# EAGLE schematic PCB2 (EAGLE 9.3.1)

## Sheet 1 of 2
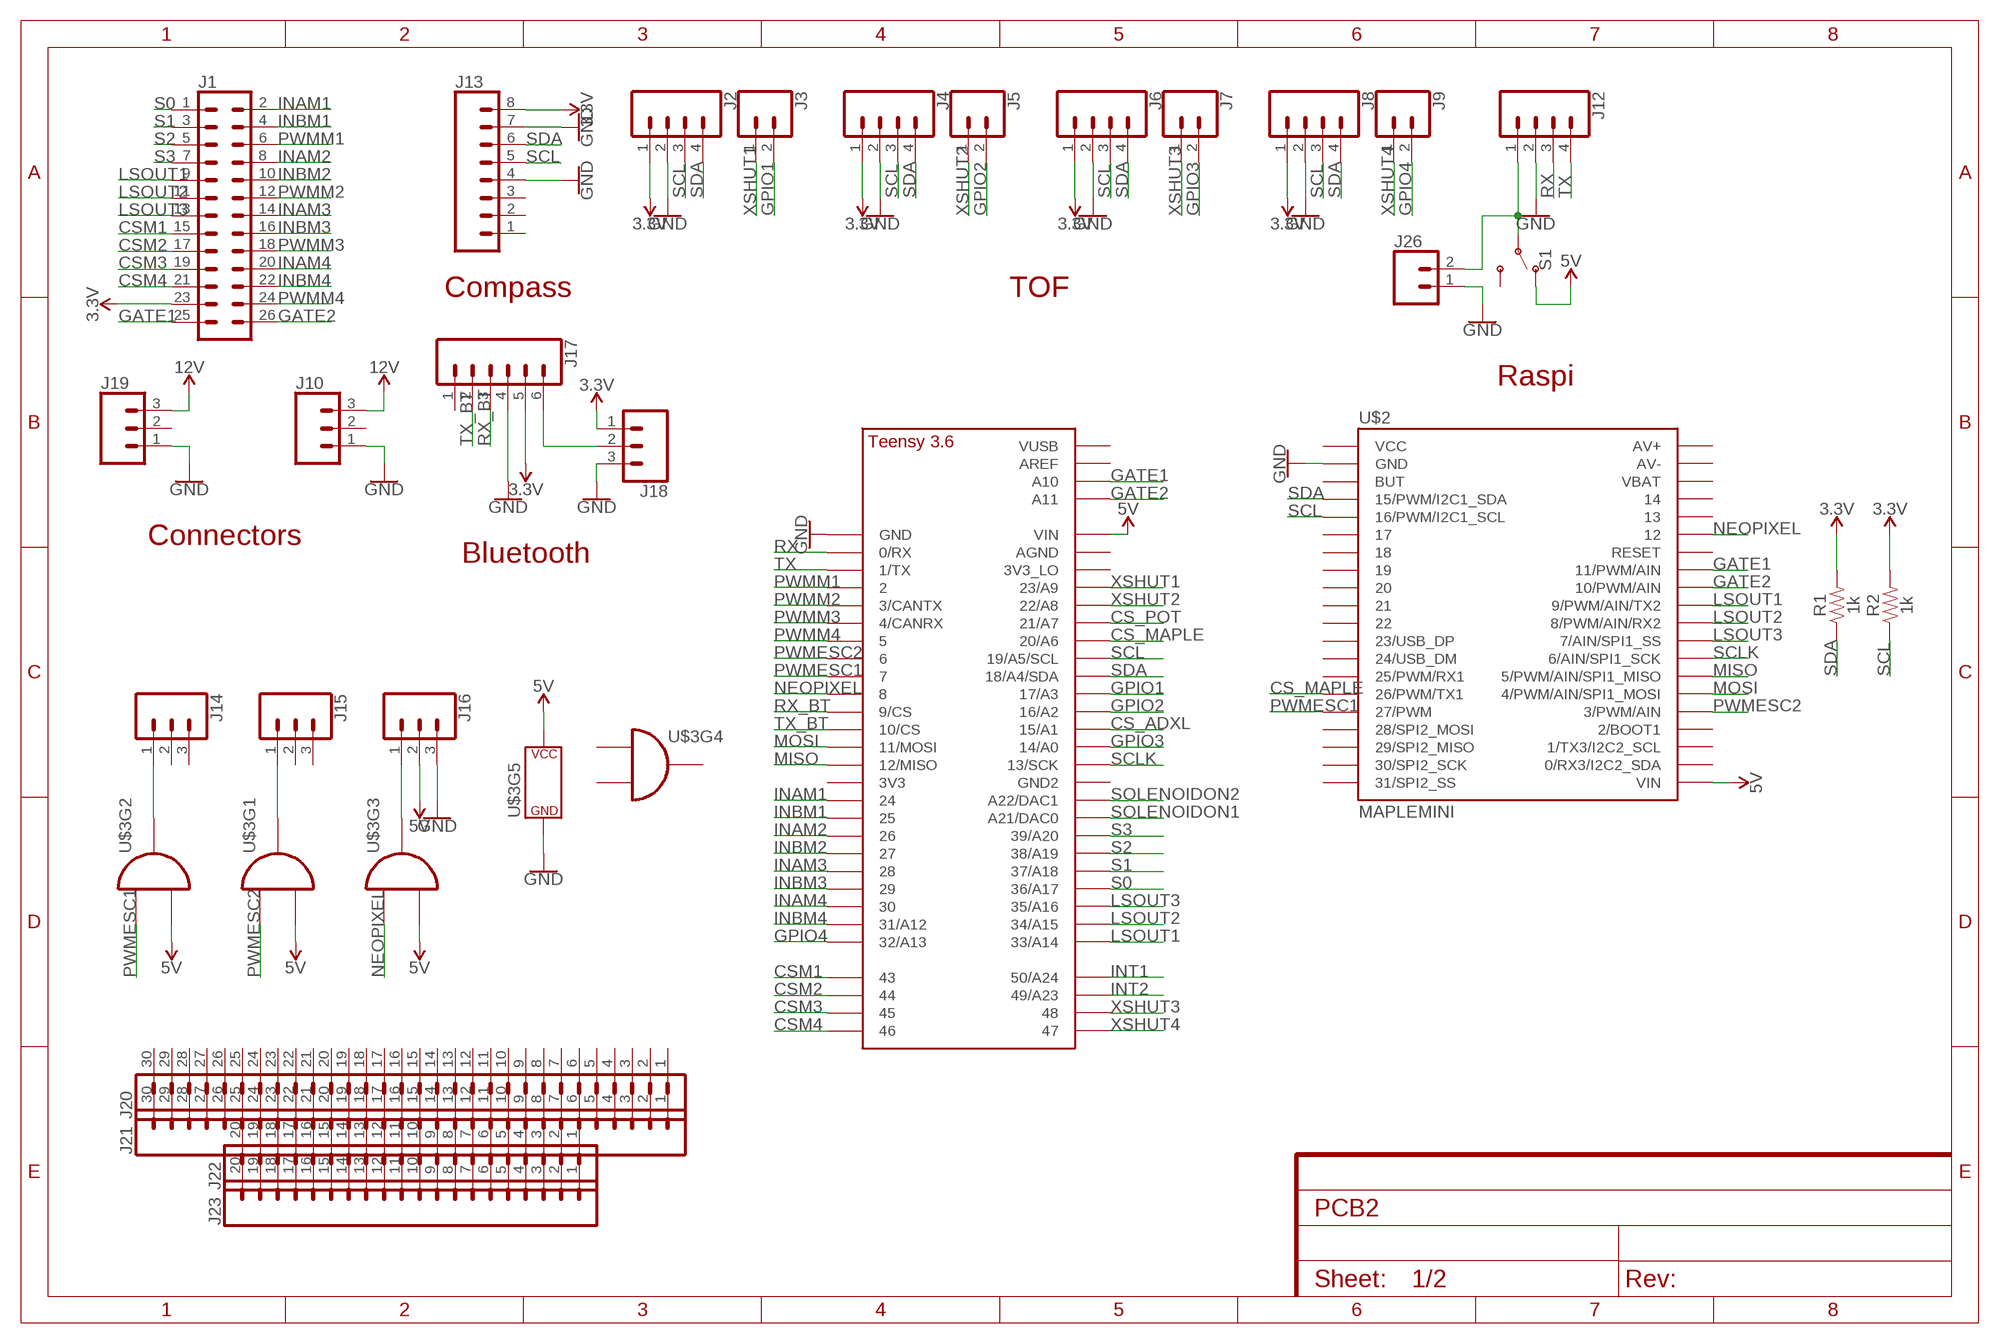
[diagram p0: schematic, sheet 1]

### Parts
J1  CONN_13X22X13  [2X13]
J2  CONN_04LOCK  [1X04_LOCK]
J3  CONN_02LOCK  [1X02_LOCK]
J4  CONN_04LOCK  [1X04_LOCK]
J5  CONN_02LOCK  [1X02_LOCK]
J6  CONN_04LOCK  [1X04_LOCK]
J7  CONN_02LOCK  [1X02_LOCK]
J8  CONN_04LOCK  [1X04_LOCK]
J9  CONN_02LOCK  [1X02_LOCK]
J10  CONN_03-SCREW-5MM  [SCREWTERMINAL-5MM-3]
J12  CONN_04LOCK  [1X04_LOCK]
J13  CONN_08LOCK  [1X08_LOCK]
J14  CONN_03LOCK  [1X03_LOCK]
J15  CONN_03LOCK  [1X03_LOCK]
J16  CONN_03LOCK  [1X03_LOCK]
J17  CONN_06LOCK  [1X06_LOCK]
J18  CONN_03LOCK  [1X03_LOCK]
J19  CONN_03-SCREW-5MM  [SCREWTERMINAL-5MM-3]
J20  CONN_30  [1X30]
J21  CONN_30  [1X30]
J22  CONN_20  [1X20]
J23  CONN_20  [1X20]
J26  CONN_02LOCK  [1X02_LOCK]
R1  1k  1KOHM-0603-1/10W-1%  [0603]
R2  1k  1KOHM-0603-1/10W-1%  [0603]
S1  SWITCH-SPDT-PTH-11.6X4.0MM-LOCK  [SWITCH_SPDT_PTH_11.6X4.0MM_LOCK]
U$1  TEENSY_3.5/3.6_BASIC  [TEENSY_3.5/3.6_BASIC]
U$2  MAPLEMINI  [20-DIP]
U$3  74HCT08  [SOIC-14]

### Nets
3.3V: J1.23 J2.1 J4.1 J6.1 J8.1 J13.8 J17.5 J18.1 R1.2 R2.2 ; also sheet 2
5V: J16.2 S1.1(O) U$1.VIN U$2.21(VIN) U$3.P2(I1) U$3.P5(I1) U$3.P10(I1) U$3.P14(P$V+) ; also sheet 2
12V: J10.3 J19.3 ; also sheet 2
CS_ADXL: U$1.15/A1 ; also sheet 2
CS_MAPLE: U$1.20/A6 U$2.15(26/PWM/TX1)
CS_POT: U$1.21/A7 ; also sheet 2
CSM1: J1.15 U$1.43
CSM2: J1.17 U$1.44
CSM3: J1.19 U$1.45
CSM4: J1.21 U$1.46
GATE1: J1.25 U$1.A10 U$2.33(11/PWM/AIN)
GATE2: J1.26 U$1.A11 U$2.32(10/PWM/AIN)
GND: J2.2 J4.2 J6.2 J8.2 J10.1 J12.2 J13.4 J13.7 J16.3 J17.4 J18.3 J19.1 J26.1 U$1.GND U$2.2(GND) U$3.P7(P$V-) ; also sheet 2
GPIO1: J3.2 U$1.17/A3
GPIO2: J5.2 U$1.16/A2
GPIO3: J7.2 U$1.14/A0
GPIO4: J9.2 U$1.32/A13
INAM1: J1.2 U$1.24
INAM2: J1.8 U$1.26
INAM3: J1.14 U$1.28
INAM4: J1.20 U$1.30
INBM1: J1.4 U$1.25
INBM2: J1.10 U$1.27
INBM3: J1.16 U$1.29
INBM4: J1.22 U$1.31/A12
INT1: U$1.50/A24 ; also sheet 2
INT2: U$1.49/A23 ; also sheet 2
LSOUT1: J1.9 U$1.33/A14 U$2.31(9/PWM/AIN/TX2)
LSOUT2: J1.11 U$1.34/A15 U$2.30(8/PWM/AIN/RX2)
LSOUT3: J1.13 U$1.35/A16 U$2.29(7/AIN/SPI1_SS)
MISO: U$1.12/MISO U$2.27(5/PWM/AIN/SPI1_MISO) ; also sheet 2
MOSI: U$1.11/MOSI U$2.26(4/PWM/AIN/SPI1_MOSI) ; also sheet 2
N$1: J12.1 J26.2 S1.2(P)
N$3: J16.1 U$3.P8(O)
N$4: J14.1 U$3.P6(O)
N$6: J15.1 U$3.P3(O)
N$11: J17.6 J18.2
NEOPIXEL: U$1.8 U$2.35 U$3.P9(I0)
PWMESC1: U$1.7 U$2.16(27/PWM) U$3.P4(I0)
PWMESC2: U$1.6 U$2.25(3/PWM/AIN) U$3.P1(I0)
PWMM1: J1.6 U$1.2
PWMM2: J1.12 U$1.3/CANTX
PWMM3: J1.18 U$1.4/CANRX
PWMM4: J1.24 U$1.5
RX: J12.3 U$1.0/RX
RX_BT: J17.3 U$1.9/CS
S0: J1.1 U$1.36/A17
S1: J1.3 U$1.37/A18
S2: J1.5 U$1.38/A19
S3: J1.7 U$1.39/A20
SCL: J2.3 J4.3 J6.3 J8.3 J13.5 R2.1 U$1.19/A5/SCL U$2.5(16/PWM/I2C1_SCL)
SCLK: U$1.13/SCK U$2.28(6/AIN/SPI1_SCK) ; also sheet 2
SDA: J2.4 J4.4 J6.4 J8.4 J13.6 R1.1 U$1.18/A4/SDA U$2.4(15/PWM/I2C1_SDA)
SOLENOIDON1: U$1.21/DAC0(A21/DAC0) ; also sheet 2
SOLENOIDON2: U$1.A22/DAC1 ; also sheet 2
TX: J12.4 U$1.1/TX
TX_BT: J17.2 U$1.10/CS
XSHUT1: J3.1 U$1.23/A9
XSHUT2: J5.1 U$1.22/A8
XSHUT3: J7.1 U$1.48
XSHUT4: J9.1 U$1.47
Unconnected: J10.2 J13.1 J13.2 J13.3 J14.2 J14.3 J15.2 J15.3 J17.1 J19.2 J20.1 J20.2 J20.3 J20.4 J20.5 J20.6 J20.7 J20.8 J20.9 J20.10 J20.11 J20.12 J20.13 J20.14 J20.15 J20.16 J20.17 J20.18 J20.19 J20.20 J20.21 J20.22 J20.23 J20.24 J20.25 J20.26 J20.27 J20.28 J20.29 J20.30 J21.1 J21.2 J21.3 J21.4 J21.5 J21.6 J21.7 J21.8 J21.9 J21.10 J21.11 J21.12 J21.13 J21.14 J21.15 J21.16 J21.17 J21.18 J21.19 J21.20 J21.21 J21.22 J21.23 J21.24 J21.25 J21.26 J21.27 J21.28 J21.29 J21.30 J22.1 J22.2 J22.3 J22.4 J22.5 J22.6 J22.7 J22.8 J22.9 J22.10 J22.11 J22.12 J22.13 J22.14 J22.15 J22.16 J22.17 J22.18 J22.19 J22.20 J23.1 J23.2 J23.3 J23.4 J23.5 J23.6 J23.7 J23.8 J23.9 J23.10 J23.11 J23.12 J23.13 J23.14 J23.15 J23.16 J23.17 J23.18 J23.19 J23.20 S1.3(S) U$1.3V3 U$1.3V3_LO U$1.AGND U$1.AREF U$1.GND2 U$1.VUSB U$2.1(VCC) U$2.3(BUT) U$2.6 U$2.7 U$2.8 U$2.9 U$2.10 U$2.11 U$2.12(23/USB_DP) U$2.13(24/USB_DM) U$2.14(25/PWM/RX1) U$2.17(28/SPI2_MOSI) U$2.18(29/SPI2_MISO) U$2.19(30/SPI2_SCK) U$2.20(31/SPI2_SS) U$2.22(0/RX3/I2C2_SDA) U$2.23(1/TX3/I2C2_SCL) U$2.24(2/BOOT1) U$2.34(RESET) U$2.36 U$2.37 U$2.38(VBAT) U$2.39(AV-) U$2.40(AV+) U$3.P11(O) U$3.P12(I0) U$3.P13(I1)

### Notes on the sheet
- Compass | TOF
- Raspi
- Connectors
- Bluetooth

## Sheet 2 of 2
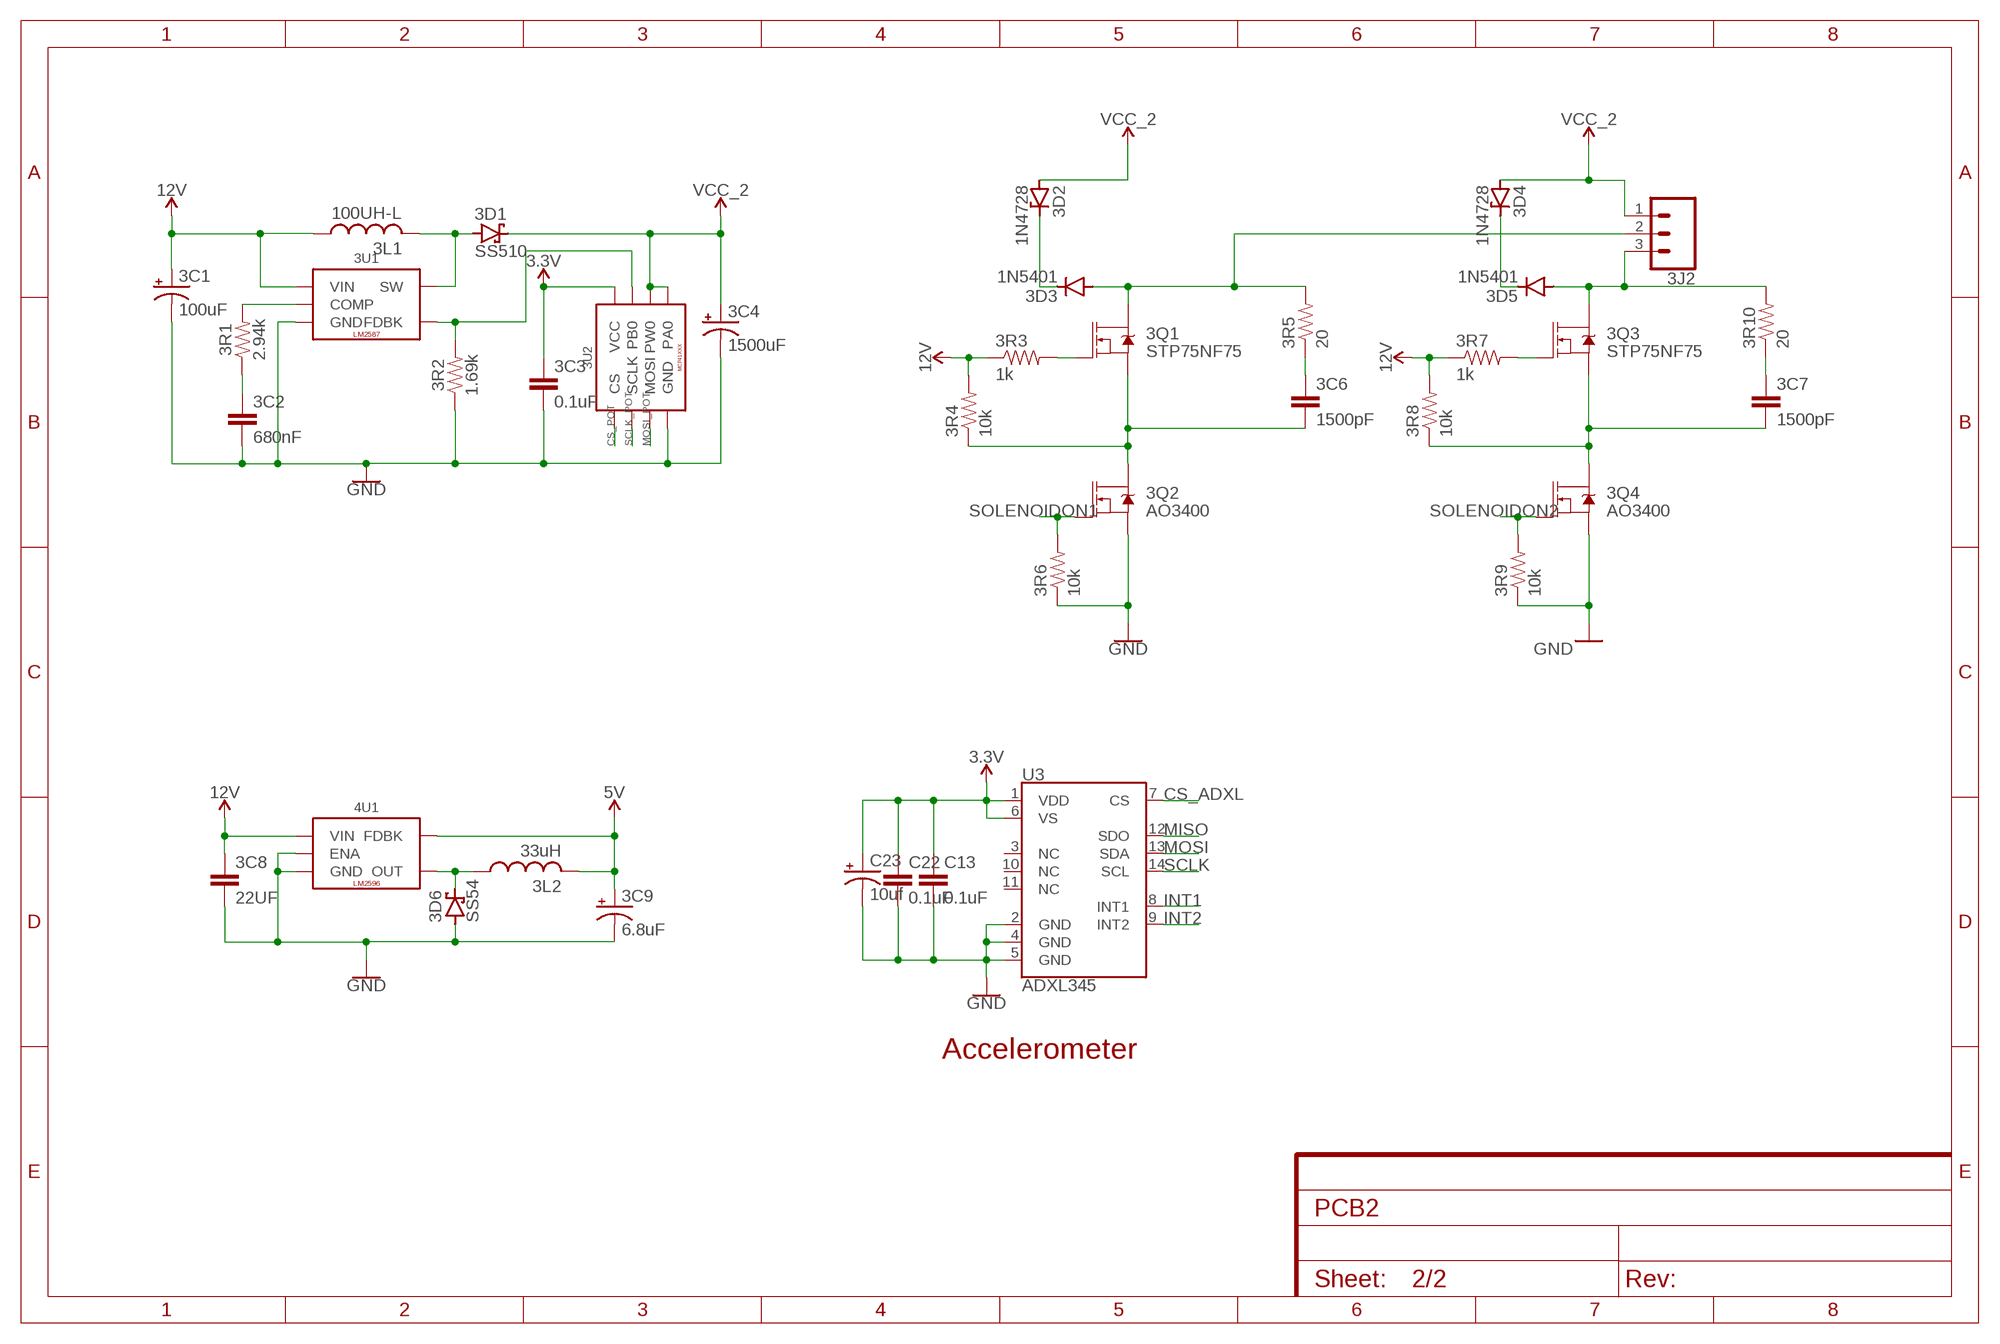
[diagram p1: schematic, sheet 2]

### Parts
3C1  100uF  100UF-POLAR-25V-20%(ELEC)  [PANASONIC_D]
3C2  680nF  680PF-0603-50V-10%  [0603]
3C3  0.1uF  0.1UF-0603-25V-5%  [0603]
3C4  1500uF  1000UF-CAP  [1000UF-CAP]
3C6  1500pF  1.5PF-0603-50V-16.667%  [0603]
3C7  1500pF  1.5PF-0603-50V-16.667%  [0603]
3C8  22UF  22UF-1210-16V-20%  [1210]
3C9  6.8uF  CPOL-USA/3216-18R  [A/3216-18R]
3D1  SS510  SCHOTTKY-DIODESMD  [SMB]
3D2  1N4728  [DO41Z10]
3D3  1N5401  1N5400  [DO201-15]
3D4  1N4728  [DO41Z10]
3D5  1N5401  1N5400  [DO201-15]
3D6  SS54  SCHOTTKY-DIODESMD  [SMB]
3J2  CONN_03-SCREW-5MM  [SCREWTERMINAL-5MM-3]
3L1  100UH-L  [100UH-L]
3L2  33uH  CDRH127  [127]
3Q1  STP75NF75  MOSFET-NCH-FQP30N06L  [TO220V]
3Q2  AO3400  MOSFET-NCH-AO3404A  [SOT23-3]
3Q3  STP75NF75  MOSFET-NCH-FQP30N06L  [TO220V]
3Q4  AO3400  MOSFET-NCH-AO3404A  [SOT23-3]
3R1  2.94k  RESISTOR0603  [0603]
3R2  1.69k  2.0KOHM-0603-1/10W-5%  [0603]
3R3  1k  1KOHM-0603-1/10W-1%  [0603]
3R4  10k  10KOHM-0603-1/10W-1%  [0603]
3R5  20  20OHM-0603-1/10W-1%  [0603]
3R6  10k  10KOHM-0603-1/10W-1%  [0603]
3R7  1k  1KOHM-0603-1/10W-1%  [0603]
3R8  10k  10KOHM-0603-1/10W-1%  [0603]
3R9  10k  10KOHM-0603-1/10W-1%  [0603]
3R10  20  20OHM-0603-1/10W-1%  [0603]
3U1  LM2587  [TO-263]
3U2  MCP41XXX  [SOIC-8]
4U1  LM2596  [TO-263]
C13  0.1uF  0.1UF-0603-100V-10%  [0603]
C22  0.1uF  0.1UF-0603-100V-10%  [0603]
C23  10uf  CPOL-USR/2012-12R  [R/2012-12R]
U3  ADXL345  [LGA-14]

### Nets
3.3V: 3C3.1 3U2.8(VCC) C13.1 C22.1 C23.+ U3.1(VDD) U3.6(VS) ; also sheet 1
5V: 3C9.+ 3L2.2 4U1.P4(FDBK) ; also sheet 1
12V: 3C1.+ 3C8.1 3L1.P1 3R3.1 3R4.2 3R7.1 3R8.2 3U1.P5(VIN) 4U1.P1(VIN) ; also sheet 1
CS_ADXL: U3.7(CS) ; also sheet 1
CS_POT: 3U2.1(CS) ; also sheet 1
GND: 3C1.- 3C2.2 3C3.2 3C4.- 3C8.2 3C9.- 3D6.A 3Q2.2(S) 3Q4.2(S) 3R2.1 3R6.1 3R9.1 3U1.P3(GND) 3U2.4(GND) 4U1.P3(GND) 4U1.P5(ENA) 4U1.TAB(GND) C13.2 C22.2 C23.- U3.2(GND) U3.4(GND) U3.5(GND) ; also sheet 1
INT1: U3.8(INT1) ; also sheet 1
INT2: U3.9(INT2) ; also sheet 1
MISO: U3.12(SDO) ; also sheet 1
MOSI: U3.13(SDA) ; also sheet 1
MOSI_POT: 3U2.3(MOSI)
N$34: 3D1.A 3L1.P2 3U1.P4(SW)
N$35: 3C6.2 3Q1.3(S) 3Q2.3(D) 3R4.1
N$36: 3R1.2 3U1.P1(COMP)
N$37: 3C2.1 3R1.1
N$38: 3Q1.1(G) 3R3.2
N$39: 3D2.C 3D3.C
N$40: 3C6.1 3R5.1
N$42: 3C7.2 3Q3.3(S) 3Q4.3(D) 3R8.1
N$43: 3Q3.1(G) 3R7.2
N$44: 3D4.C 3D5.C
N$45: 3C7.1 3R10.1
N$47: 3D6.C 3L2.1 4U1.P2(OUT)
N$103: 3R2.2 3U1.P2(FDBK) 3U2.7(PB0)
SCLK: U3.14(SCL) ; also sheet 1
SCLK_POT: 3U2.2(SCLK)
SOLENOID-: 3D3.A 3J2.2 3Q1.2(D) 3R5.2
SOLENOID-1: 3D5.A 3J2.3 3Q3.2(D) 3R10.2
SOLENOIDON1: 3Q2.1(G) 3R6.2 ; also sheet 1
SOLENOIDON2: 3Q4.1(G) 3R9.2 ; also sheet 1
VCC_2: 3C4.+ 3D1.C 3D2.A 3D4.A 3J2.1 3U2.5(PA0) 3U2.6(PW0)
Unconnected: U3.3(NC) U3.10(NC) U3.11(NC)

### Notes on the sheet
- Accelerometer

## Library data of the parts
3C1 = SparkFun-Capacitors:100UF-POLAR: 100µF polarized capacitors A capacitor is a passive two-terminal electrical component used to store electrical energy temporarily in an electric field.; PROD_ID: CAP-12547
3C2 = SparkFun-Capacitors:680PF: 680pF/0.68nF ceramic capacitors A capacitor is a passive two-terminal electrical component used to store electrical energy temporarily in an electric field.; PROD_ID: CAP-09232; VALUE: 680pF
3C3 = SparkFun-Capacitors:0.1UF: 0.1µF ceramic capacitors A capacitor is a passive two-terminal electrical component used to store electrical energy temporarily in an electric field.; PROD_ID: CAP-08604
3C4 = JH:1000UF-CAP
3C6 3C7 = SparkFun-Capacitors:1.5PF: 1.5pF ceramic capacitors A capacitor is a passive two-terminal electrical component used to store electrical energy temporarily in an electric field.; PROD_ID: CAP-08763; VALUE: 1.5pF
3C8 = SparkFun-Capacitors:22UF: 22µF ceramic capacitors A capacitor is a passive two-terminal electrical component used to store electrical energy temporarily in an electric field.
3C9 C23 = rcl:CPOL-US: POLARIZED CAPACITOR, American symbol; SPICEPREFIX: C
3D1 3D6 = diode:SCHOTTKY-DIODE: Schottky Diode
3D2 3D4 = diode:1N4728: Z DIODE 3.3 V, 1W, 5 percent
3D3 3D5 = diode:1N5400: DIODE standard rectifier, 3 A, 50 V (Motorola)
3J2 J10 J19 = SparkFun-Connectors:CONN_03: Multi connection point. Often used as Generic Header-pin footprint for 0.1 inch spaced/style header connections On any of the 0.1 inch spaced packages, you can populate with these: Break Away Headers - Straight <https://www.sparkfun.com/products/116> (PRT-00116) Break Away Male Headers - Right Angle <https://www.sparkfun.com/products/553> (PRT-00553) Female Headers <https://www.sparkfun.com/products/115> (PRT-00115) Break Away Headers - Machine Pin <https://www.sparkfun.com/products/117> (PRT-00117) Break Away Female Headers - Swiss Machine Pin <https://www.sparkfun.com/products/743> (PRT-00743) Stackable Header - 3 Pin (Female, 0.1") <https://www.sparkfun.com/products/13875> (PRT-13875) For SCREWTERMINALS and SPRING TERMINALS visit here: Screw Terimnals on SparkFun.com <https://www.sparkfun.com/search/results?term=Screw+Terminals> (5mm/3.5mm/2.54mm spacing) This device is also useful as a general connection point to wire up your design to another part of your project. Our various solder wires solder well into these plated through hole pads. Hook-Up Wire - Assortment (Stranded, 22 AWG) <https://www.sparkfun.com/products/11375> (PRT-11375) Hook-Up Wire - Assortment (Solid Core, 22 AWG) <https://www.sparkfun.com/products/11367> (PRT-11367) View the entire wire category on our website here <https://www.sparkfun.com/categories/141> Special notes: Molex polarized connector foot print use with SKU : PRT-08232 with associated crimp pins and housings.; PROD_ID: CONN-10134; SF_SKU: PRT-08433
3L1 = JH:100UH-L
3L2 = JH:CDRH127
3Q1 3Q3 = SparkFun-DiscreteSemi:MOSFET-NCH: N-channel MOSFETs Voltage controlled devices that allow control of high current outputs. SparkFun Products: SparkFun OpenScale <https://www.sparkfun.com/products/13261> SparkFun Digital Sandbox <https://www.sparkfun.com/products/12651> SparkFun Monster Moto Shield <https://www.sparkfun.com/products/10182> SparkFun MOSFET Power Controller <https://www.sparkfun.com/products/11214>; PROD_ID: TRANS-10060; VALUE: 60V/32A/35mΩ
3Q2 3Q4 = SparkFun-DiscreteSemi:MOSFET-NCH: N-channel MOSFETs Voltage controlled devices that allow control of high current outputs. SparkFun Products: SparkFun OpenScale <https://www.sparkfun.com/products/13261> SparkFun Digital Sandbox <https://www.sparkfun.com/products/12651> SparkFun Monster Moto Shield <https://www.sparkfun.com/products/10182> SparkFun MOSFET Power Controller <https://www.sparkfun.com/products/11214>; PROD_ID: TRANS-12988; VALUE: 5.8A/30V/35mΩ
3R1 = SparkFun-Resistors:RESISTOR: Generic Resistor Package
3R2 = SparkFun-Resistors:2.0KOHM: 2kΩ resistor A resistor is a passive two-terminal electrical component that implements electrical resistance as a circuit element. Resistors act to reduce current flow, and, at the same time, act to lower voltage levels within circuits. - Wikipedia; PROD_ID: RES-08296; VALUE: 2.0k
3R3 3R7 R1 R2 = SparkFun-Resistors:1KOHM: 1kΩ resistor A resistor is a passive two-terminal electrical component that implements electrical resistance as a circuit element. Resistors act to reduce current flow, and, at the same time, act to lower voltage levels within circuits. - Wikipedia; PROD_ID: RES-07856
3R4 3R6 3R8 3R9 = SparkFun-Resistors:10KOHM: 10kΩ resistor A resistor is a passive two-terminal electrical component that implements electrical resistance as a circuit element. Resistors act to reduce current flow, and, at the same time, act to lower voltage levels within circuits. - Wikipedia; PROD_ID: RES-00824
3R5 3R10 = SparkFun-Resistors:20OHM: RES-07862; PROD_ID: RES-07862
3U1 = JH:LM2587
3U2 = JH:MCP41XXX
4U1 = JH:LM2596
C13 C22 = SparkFun-Capacitors:0.1UF: 0.1µF ceramic capacitors A capacitor is a passive two-terminal electrical component used to store electrical energy temporarily in an electric field.; PROD_ID: CAP-08390
J1 = SparkFun-Connectors:CONN_13X2: Multi connection point. Often used as Generic Header-pin footprint for 0.1 inch spaced/style header connections On any of the 0.1 inch spaced packages, you can populate with these: Break Away Headers - Straight <https://www.sparkfun.com/products/116> (PRT-00116) Break Away Male Headers - Right Angle <https://www.sparkfun.com/products/553> (PRT-00553) Female Headers <https://www.sparkfun.com/products/115> (PRT-00115) Break Away Headers - Machine Pin <https://www.sparkfun.com/products/117> (PRT-00117) Break Away Female Headers - Swiss Machine Pin <https://www.sparkfun.com/products/743> (PRT-00743)
J2 J4 J6 J8 J12 = SparkFun-Connectors:CONN_04: Multi connection point. Often used as Generic Header-pin footprint for 0.1 inch spaced/style header connections On any of the 0.1 inch spaced packages, you can populate with these: Break Away Headers - Straight <https://www.sparkfun.com/products/116> (PRT-00116) Break Away Male Headers - Right Angle <https://www.sparkfun.com/products/553> (PRT-00553) Female Headers <https://www.sparkfun.com/products/115> (PRT-00115) Break Away Headers - Machine Pin <https://www.sparkfun.com/products/117> (PRT-00117) Break Away Female Headers - Swiss Machine Pin <https://www.sparkfun.com/products/743> (PRT-00743) For SCREWTERMINALS and SPRING TERMINALS visit here: Screw Terimnals on SparkFun.com <https://www.sparkfun.com/search/results?term=Screw+Terminals> (5mm/3.5mm/2.54mm spacing) This device is also useful as a general connection point to wire up your design to another part of your project. Our various solder wires solder well into these plated through hole pads. Hook-Up Wire - Assortment (Stranded, 22 AWG) <https://www.sparkfun.com/products/11375> (PRT-11375) Hook-Up Wire - Assortment (Solid Core, 22 AWG) <https://www.sparkfun.com/products/11367> (PRT-11367) View the entire wire category on our website here <https://www.sparkfun.com/categories/141> Special notes: Molex polarized connector foot print use with SKU : PRT-08231 with associated crimp pins and housings. 1MM SMD Version SKU: PRT-10208; PROD_ID: CONN-09696
J3 J5 J7 J9 J26 = SparkFun-Connectors:CONN_02: Multi connection point. Often used as Generic Header-pin footprint for 0.1 inch spaced/style header connections On any of the 0.1 inch spaced packages, you can populate with these: Break Away Headers - Straight <https://www.sparkfun.com/products/116> (PRT-00116) Break Away Male Headers - Right Angle <https://www.sparkfun.com/products/553> (PRT-00553) Female Headers <https://www.sparkfun.com/products/115> (PRT-00115) Break Away Headers - Machine Pin <https://www.sparkfun.com/products/117> (PRT-00117) Break Away Female Headers - Swiss Machine Pin <https://www.sparkfun.com/products/743> (PRT-00743) For SCREWTERMINALS and SPRING TERMINALS visit here: Screw Terimnals on SparkFun.com <https://www.sparkfun.com/search/results?term=Screw+Terminals> (5mm/3.5mm/2.54mm spacing) This device is also useful as a general connection point to wire up your design to another part of your project. Our various solder wires solder well into these plated through hole pads. Hook-Up Wire - Assortment (Stranded, 22 AWG) <https://www.sparkfun.com/products/11375> (PRT-11375) Hook-Up Wire - Assortment (Solid Core, 22 AWG) <https://www.sparkfun.com/products/11367> (PRT-11367) View the entire wire category on our website here <https://www.sparkfun.com/categories/141> Special notes: Molex polarized connector foot print use with: PRT-08233 with associated crimp pins and housings. 2.54_SCREWTERM for use with PRT-10571. 3.5mm Screw Terminal footprints for PRT-08084 5mm Screw Terminal footprints for use with PRT-08432
J13 = SparkFun-Connectors:CONN_08: Multi connection point. Often used as Generic Header-pin footprint for 0.1 inch spaced/style header connections On any of the 0.1 inch spaced packages, you can populate with these: Break Away Headers - Straight <https://www.sparkfun.com/products/116> (PRT-00116) Break Away Male Headers - Right Angle <https://www.sparkfun.com/products/553> (PRT-00553) Female Headers <https://www.sparkfun.com/products/115> (PRT-00115) Break Away Headers - Machine Pin <https://www.sparkfun.com/products/117> (PRT-00117) Break Away Female Headers - Swiss Machine Pin <https://www.sparkfun.com/products/743> (PRT-00743) Arduino Stackable Header - 8 Pin <https://www.sparkfun.com/products/9279> (PRT-09279) For SCREWTERMINALS and SPRING TERMINALS visit here: Screw Terimnals on SparkFun.com <https://www.sparkfun.com/search/results?term=Screw+Terminals> (5mm/3.5mm/2.54mm spacing) This device is also useful as a general connection point to wire up your design to another part of your project. Our various solder wires solder well into these plated through hole pads. Hook-Up Wire - Assortment (Stranded, 22 AWG) <https://www.sparkfun.com/products/11375> (PRT-11375) Hook-Up Wire - Assortment (Solid Core, 22 AWG) <https://www.sparkfun.com/products/11367> (PRT-11367) View the entire wire category on our website here <https://www.sparkfun.com/categories/141> Special notes: Molex polarized connector foot print use with SKU : PRT-08231 with associated crimp pins and housings. 1MM SMD Version SKU: PRT-10208 NOTES ON THE VARIANTS LOCK and LOCK_LONGPADS... This footprint was designed to help hold the alignment of a through-hole component (i.e. 6-pin header) while soldering it into place. You may notice that each hole has been shifted either up or down by 0.005 of an inch from it's more standard position (which is a perfectly straight line). This slight alteration caused the pins (the squares in the middle) to touch the edges of the holes. Because they are alternating, it causes a "brace" to hold the component in place. 0.005 has proven to be the perfect amount of "off-center" position when using our standard breakaway headers. Although looks a little odd when you look at the bare footprint, once you have a header in there, the alteration is very hard to notice. Also,if you push a header all the way into place, it is covered up entirely on the bottom side.
J14-J16 J18 = SparkFun-Connectors:CONN_03: Multi connection point. Often used as Generic Header-pin footprint for 0.1 inch spaced/style header connections On any of the 0.1 inch spaced packages, you can populate with these: Break Away Headers - Straight <https://www.sparkfun.com/products/116> (PRT-00116) Break Away Male Headers - Right Angle <https://www.sparkfun.com/products/553> (PRT-00553) Female Headers <https://www.sparkfun.com/products/115> (PRT-00115) Break Away Headers - Machine Pin <https://www.sparkfun.com/products/117> (PRT-00117) Break Away Female Headers - Swiss Machine Pin <https://www.sparkfun.com/products/743> (PRT-00743) Stackable Header - 3 Pin (Female, 0.1") <https://www.sparkfun.com/products/13875> (PRT-13875) For SCREWTERMINALS and SPRING TERMINALS visit here: Screw Terimnals on SparkFun.com <https://www.sparkfun.com/search/results?term=Screw+Terminals> (5mm/3.5mm/2.54mm spacing) This device is also useful as a general connection point to wire up your design to another part of your project. Our various solder wires solder well into these plated through hole pads. Hook-Up Wire - Assortment (Stranded, 22 AWG) <https://www.sparkfun.com/products/11375> (PRT-11375) Hook-Up Wire - Assortment (Solid Core, 22 AWG) <https://www.sparkfun.com/products/11367> (PRT-11367) View the entire wire category on our website here <https://www.sparkfun.com/categories/141> Special notes: Molex polarized connector foot print use with SKU : PRT-08232 with associated crimp pins and housings.
J17 = SparkFun-Connectors:CONN_06: Multi connection point. Often used as Generic Header-pin footprint for 0.1 inch spaced/style header connections On any of the 0.1 inch spaced packages, you can populate with these: Break Away Headers - Straight <https://www.sparkfun.com/products/116> (PRT-00116) Break Away Male Headers - Right Angle <https://www.sparkfun.com/products/553> (PRT-00553) Female Headers <https://www.sparkfun.com/products/115> (PRT-00115) Break Away Headers - Machine Pin <https://www.sparkfun.com/products/117> (PRT-00117) Break Away Female Headers - Swiss Machine Pin <https://www.sparkfun.com/products/743> (PRT-00743) Arduino Stackable Header - 6 Pin <https://www.sparkfun.com/products/9280> (PRT-09280) For SCREWTERMINALS and SPRING TERMINALS visit here: Screw Terimnals on SparkFun.com <https://www.sparkfun.com/search/results?term=Screw+Terminals> (5mm/3.5mm/2.54mm spacing) This device is also useful as a general connection point to wire up your design to another part of your project. Our various solder wires solder well into these plated through hole pads. Hook-Up Wire - Assortment (Stranded, 22 AWG) <https://www.sparkfun.com/products/11375> (PRT-11375) Hook-Up Wire - Assortment (Solid Core, 22 AWG) <https://www.sparkfun.com/products/11367> (PRT-11367) View the entire wire category on our website here <https://www.sparkfun.com/categories/141>
J20 J21 = SparkFun-Connectors:CONN_30: Multi connection point. Often used as Generic Header-pin footprint for 0.1 inch spaced/style header connections On any of the 0.1 inch spaced packages, you can populate with these: Break Away Headers - Straight <https://www.sparkfun.com/products/116> (PRT-00116) Break Away Male Headers - Right Angle <https://www.sparkfun.com/products/553> (PRT-00553) Female Headers <https://www.sparkfun.com/products/115> (PRT-00115) Break Away Headers - Machine Pin <https://www.sparkfun.com/products/117> (PRT-00117) Break Away Female Headers - Swiss Machine Pin <https://www.sparkfun.com/products/743> (PRT-00743) For SCREWTERMINALS and SPRING TERMINALS visit here: Screw Terimnals on SparkFun.com <https://www.sparkfun.com/search/results?term=Screw+Terminals> (5mm/3.5mm/2.54mm spacing) This device is also useful as a general connection point to wire up your design to another part of your project. Our various solder wires solder well into these plated through hole pads. Hook-Up Wire - Assortment (Stranded, 22 AWG) <https://www.sparkfun.com/products/11375> (PRT-11375) Hook-Up Wire - Assortment (Solid Core, 22 AWG) <https://www.sparkfun.com/products/11367> (PRT-11367) View the entire wire category on our website here <https://www.sparkfun.com/categories/141> Special notes: Molex polarized connector foot print use with SKU : PRT-08231 with associated crimp pins and housings. 1MM SMD Version SKU: PRT-10208 NOTES ON THE VARIANTS LOCK and LOCK_LONGPADS... This footprint was designed to help hold the alignment of a through-hole component (i.e. 6-pin header) while soldering it into place. You may notice that each hole has been shifted either up or down by 0.005 of an inch from it's more standard position (which is a perfectly straight line). This slight alteration caused the pins (the squares in the middle) to touch the edges of the holes. Because they are alternating, it causes a "brace" to hold the component in place. 0.005 has proven to be the perfect amount of "off-center" position when using our standard breakaway headers. Although looks a little odd when you look at the bare footprint, once you have a header in there, the alteration is very hard to notice. Also,if you push a header all the way into place, it is covered up entirely on the bottom side.
J22 J23 = SparkFun-Connectors:CONN_20: Multi connection point. Often used as Generic Header-pin footprint for 0.1 inch spaced/style header connections On any of the 0.1 inch spaced packages, you can populate with these: Break Away Headers - Straight <https://www.sparkfun.com/products/116> (PRT-00116) Break Away Male Headers - Right Angle <https://www.sparkfun.com/products/553> (PRT-00553) Female Headers <https://www.sparkfun.com/products/115> (PRT-00115) Break Away Headers - Machine Pin <https://www.sparkfun.com/products/117> (PRT-00117) Break Away Female Headers - Swiss Machine Pin <https://www.sparkfun.com/products/743> (PRT-00743) For SCREWTERMINALS and SPRING TERMINALS visit here: Screw Terimnals on SparkFun.com <https://www.sparkfun.com/search/results?term=Screw+Terminals> (5mm/3.5mm/2.54mm spacing) This device is also useful as a general connection point to wire up your design to another part of your project. Our various solder wires solder well into these plated through hole pads. Hook-Up Wire - Assortment (Stranded, 22 AWG) <https://www.sparkfun.com/products/11375> (PRT-11375) Hook-Up Wire - Assortment (Solid Core, 22 AWG) <https://www.sparkfun.com/products/11367> (PRT-11367) View the entire wire category on our website here <https://www.sparkfun.com/categories/141> Special notes: Molex polarized connector foot print use with SKU : PRT-08231 with associated crimp pins and housings. 1MM SMD Version SKU: PRT-10208 NOTES ON THE VARIANTS LOCK and LOCK_LONGPADS... This footprint was designed to help hold the alignment of a through-hole component (i.e. 6-pin header) while soldering it into place. You may notice that each hole has been shifted either up or down by 0.005 of an inch from it's more standard position (which is a perfectly straight line). This slight alteration caused the pins (the squares in the middle) to touch the edges of the holes. Because they are alternating, it causes a "brace" to hold the component in place. 0.005 has proven to be the perfect amount of "off-center" position when using our standard breakaway headers. Although looks a little odd when you look at the bare footprint, once you have a header in there, the alteration is very hard to notice. Also,if you push a header all the way into place, it is covered up entirely on the bottom side. Note about LOCK SPECIAL package: This is just like the LOCK variant in that the holes are staggared by 5 mil, but except for the last two holes. They are not altered from the "standard" footprint layout. This is used for a special purpose on the layout of our Graphic LCD Backpack. Make sure you want to use this device before selecting it for you project!
S1 = SparkFun-Switches:SWITCH-SPDT: Single Pole, Double Throw (SPDT) Switch Single-pole, double-throw (SPDT) switch. Variant Overview SMD-AYZ0202 Surface Mount DPDT Switch <https://www.sparkfun.com/products/597> (COM-00597) Used on e.g. LilyPad Arduino USB - ATmega32U4 Board <https://www.sparkfun.com/products/12049> PTH-11.6X4.0MM SPDT Mini Power Switch <https://www.sparkfun.com/products/102> (COM-00102) Used on e.g. SparkFun Simon Says - Through-Hole Soldering Kit <https://www.sparkfun.com/products/10547> (KIT-10547) PTH-11.6X4.0MM-KIT KIT version of SPDT Mini Power Switch - Simplifies soldering by removing tStop of switch pins - only one side can be soldered. PTH-11.6X4.0MM-LOCK LOCK version of SPDT Mini Power Switch - Offset pins hold switch in place for easier soldering. SMD-RIGHT-ANGLE Surface Mount Right Angle Switch <https://www.sparkfun.com/products/10860> (COM-10860) Used on e.g. SparkFun ESP8266 Thing <https://www.sparkfun.com/products/13231>; PROD_ID: SWCH-08261; SF_SKU: COM-00102
U3 = SparkFun-Sensors:ADXL345: Analog Devices ADXL345 3-Axis SPI/I2C 2/4/8/16g Accelerometer The ADXL345 is a small, thin, low power, 3-axis accelerometer with high resolution (13-bit) measurement at up to ±16g. Digital output data is formatted as 16-bit twos complement and is accessible through either a SPI (3- or 4-wire) or I2C digital interface. Datasheet <https://www.sparkfun.com/datasheets/Sensors/Accelerometer/ADXL345.pdf> SparkFun Products SparkFun Triple Axis Accelerometer Breakout - ADXL345 <https://www.sparkfun.com/products/9836> (SEN-09836) Triple Axis Accelerometer - ADXL345 <https://www.sparkfun.com/products/9045> (SEN-09045) SparkFun 6 Degrees of Freedom IMU Digital Combo Board - ITG3200/ADXL345 <https://www.sparkfun.com/products/10121> (SEN-10121); PROD_ID: IC-09097; SF_ID: SEN-09045
U$1 = JH:TEENSY_3.5/3.6_BASIC
U$2 = JH:MAPLEMINI
U$3 = JH:74HCT08